# Altium schematic sheet pot.SchDoc
size A
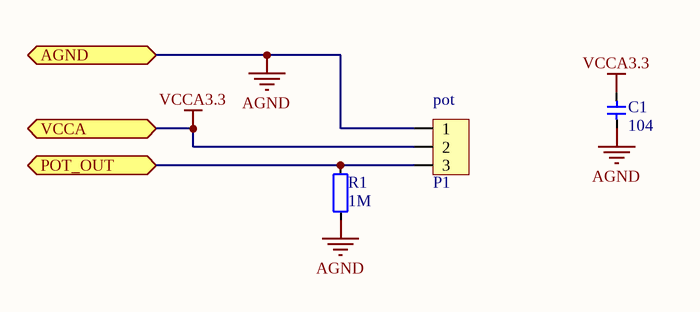
[diagram p0: pot.SchDoc]

## Parts
C1  value 104  [CAP_0603]  (hidden comment: Cap_0603)
P1  pot  [COMBICON PTSA 3]
R1  value 1M  [RES_0603]  (hidden comment: Res_0603)

## Ports
AGND, POT_OUT, VCCA

## Nets
AGND: C1.1 P1.1 R1.1 ; port AGND
VCCA3.3: C1.2 P1.2 ; port VCCA
POT_OUT: P1.3 R1.2 ; port POT_OUT

## Library data of the parts
C1 = Cap_0603: Capacitor
P1 = HDR1x3_2.54: Header
R1 = Res_0603: Resistor